# EAGLE design BUZZI-04 (EAGLE 4.15)
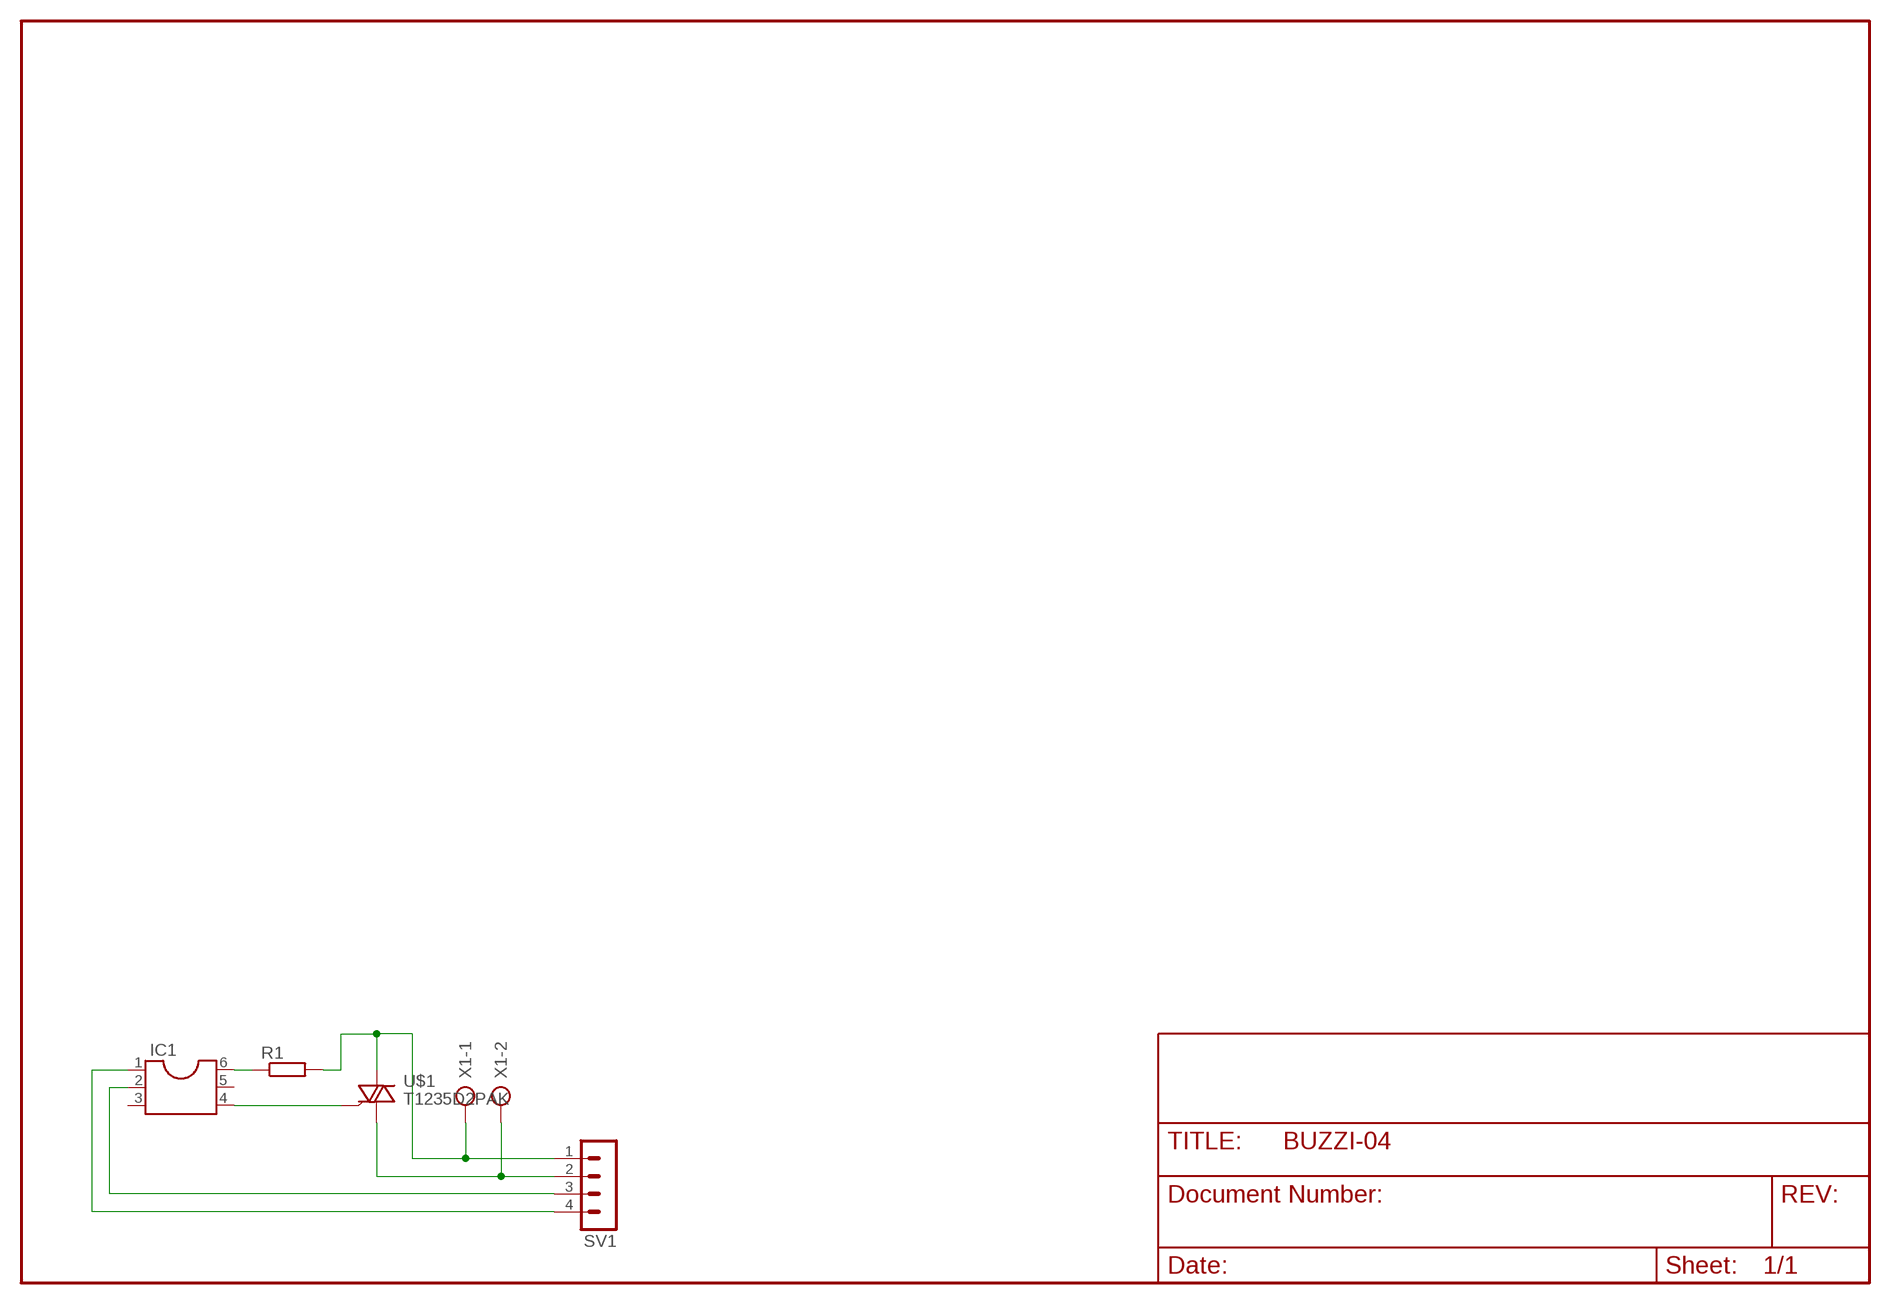
[diagram p0: schematic, sheet 1]

## Parts
IC1  DIL6  [DIL06]
R1  R-EU_R0805  [R0805]
SV1  MA04-1  [MA04-1]
U$1  T1235D2PAK  [D2PACK]
X1  AK500/2  [AK500/2]

## Nets
N$1: IC1.4 U$1.3(G)
N$2: IC1.2 SV1.3
N$3: IC1.6 R1.1
N$4: SV1.2 U$1.1(A1) X1.2
N$8: IC1.1 SV1.4
UP: R1.2 SV1.1 U$1.2(A2) X1.1
Unconnected: IC1.3 IC1.5

## Library data of the parts
IC1 = ic-package:DIL6: Dual In Line
R1 = rcl:R-EU_: RESISTOR, European symbol
SV1 = con-lstb:MA04-1: PIN HEADER
U$1 = turbod3:T1235
X1 = con-ptr500:AK500/2: CONNECTOR

## Net classes
1 high: width 4 mm

## Board
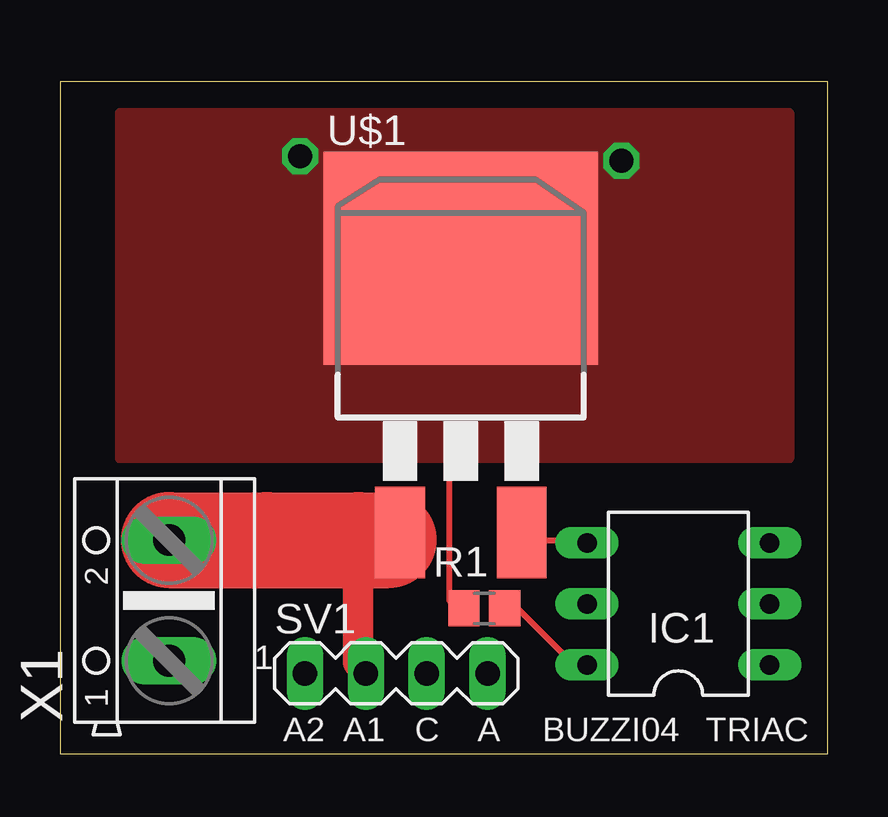
[diagram p1: board, top side]
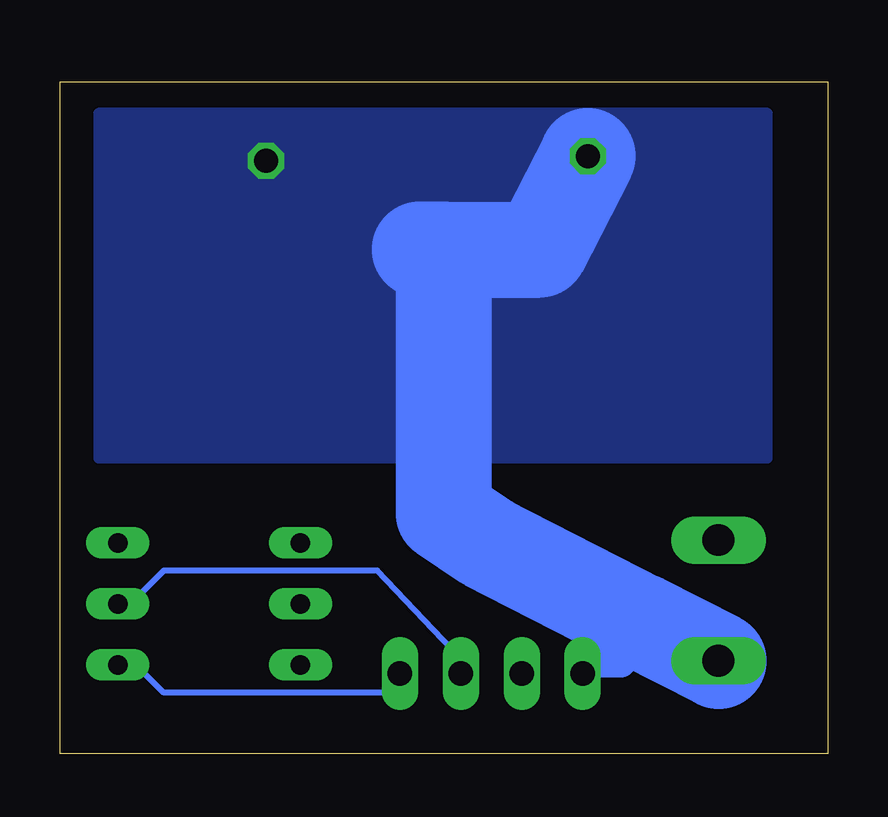
[diagram p2: board, bottom side, seen from below]

Size 32 x 28 mm. Coordinates in mm from the lower left corner, seen from the top.
Outline: 0,0 32,0 32,28 0,28 0,0
Copper layers (1*16): Top 0.035mm / dielectric 1.5mm / Bottom 0.035mm
Design rules "default": minimum track width 10mil, minimum drill 24mil, track to track 8mil, track to pad 8mil, pad to pad 8mil, via to via 8mil, smd to smd 8mil, copper to edge 40mil, drill to drill 8mil, minimum pad ring 10mil, minimum via ring 8mil, stop-mask expansion 4mil, vias tented up to drill 0mil, thermal gap 10mil

### Footprints (pad centres in the part's own frame; a part is rotated, then mirrored left to right if it is on the bottom)
DIL06 = drill 0.813 long: 1 -2.54,-3.81; 2 0,-3.81; 3 2.54,-3.81; 4 2.54,3.81; 5 0,3.81; 6 -2.54,3.81
R0805 = smd 1.3 x 1.5: 1 -0.85,0; 2 0.85,0
MA04-1 = drill 1.016 long: 1 -3.81,0; 2 -1.27,0; 3 1.27,0; 4 3.81,0
D2PACK = smd 2.083 x 3.81: 1 -2.54,-8.89; 3 2.54,-8.89 | smd 11.43 x 8.89: 2 0,2.54
AK500/2 = drill 1.321 long: 1 -2.515,0; 2 2.515,0

### Placement (x,y rotation side)
IC1  25.78,6.24 90 top
R1  17.69,6.05 180 top
SV1  14.02,3.34 0 top
U$1  16.71,18.1 0 top
X1  4.55,6.38 90 top

### Tracks (layer width: path | path; a pad name or v marks a point on that pad's centre or on a via)
N$1
  Top 0.254: IC1.4 21.32,8.89 20.05,8.89 U$1.3
N$2
  Bottom 0.254: IC1.2 28.94,6.35 27.67,7.62 18.78,7.62 15.27,3.91 SV1.3
N$3
  Top 0.254: R1.1 18.78,6.35 21.32,3.81 IC1.6
N$4
  Top 0.254: 13.7,8.89 U$1.1
  Top 1.27: SV1.2 12.43,3.81 12.43,8.89
  Top 4: 13.7,8.89 12.43,8.89 8.62,8.89 X1.2
N$8
  Bottom 0.254: IC1.1 28.94,3.81 27.67,2.54 17.81,2.54 SV1.4
UP  (via drill 1)
  Top 0.254: 16.24,12.7 16.24,6.35 R1.2
  Bottom 0.254: 14.19,8.79 14.97,7.62 | 7.75,5.5 8.62,3.81
  Bottom 1.27: 8.62,3.81 9.89,3.81 SV1.1
  Bottom 4: X1.1 7.75,5.5 14.19,8.79 16,10 16,21 | 16,21 17,21 | 16,21 12,21 v10,24.9
  other vias: 23.4,24.7
  pour Top (no thermals): 2.5,26.7 30.4,26.7 30.4,12.3 2.5,12.3
  pour Bottom (no thermals): 2.6,26.7 30.4,26.7 30.4,12.3 2.5,12.3 2.5,26.7 2.9,26.7

### Text on the board
tPlace: A2 | A1 | C | A | BUZZI04 | TRIAC